# Altium schematic sheet Measurement.SchDoc
size A3; SheetNumber: 5; SheetTotal: 5
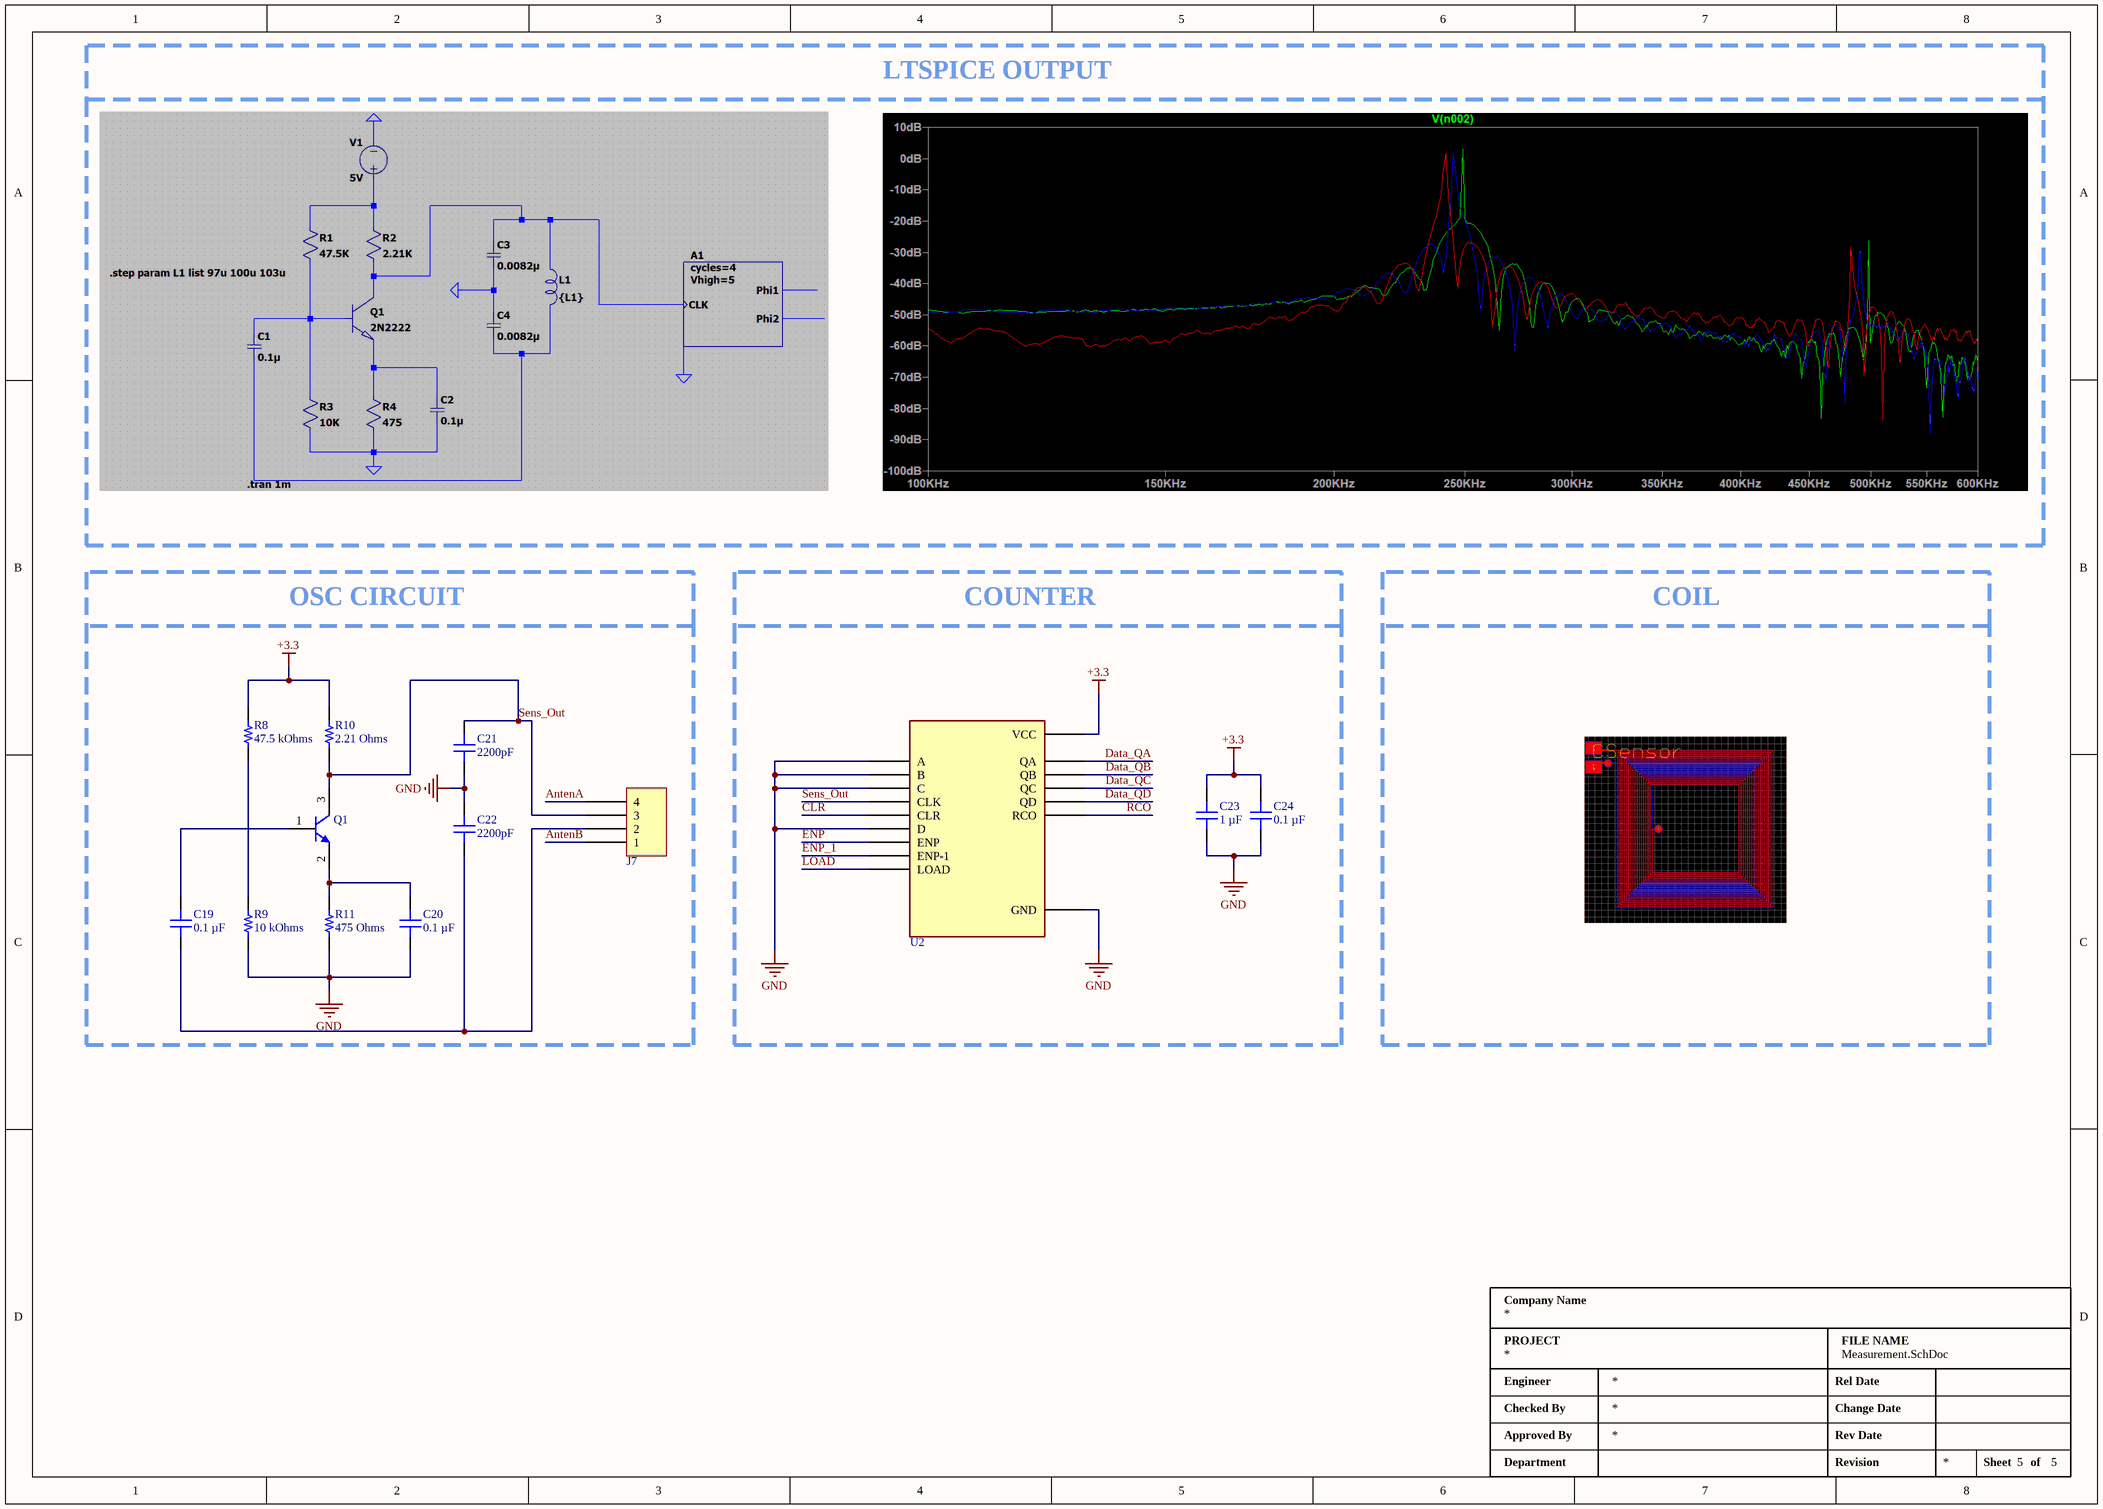
[diagram p0: Measurement.SchDoc]

## Parts
C19  0.1 µF  [CAP 0603_1608]
C20  0.1 µF  [CAP 0603_1608]
C21  2200pF  [CAP 0603_1608]
C22  2200pF  [CAP 0603_1608]
C23  1 µF  [CAP 0603_1608]
C24  0.1 µF  [CAP 0805_2012]
J7  SSW-104-03-T-S  [SAMTEC SSW-104-03-T-S]  (value not drawn)
Q1  MMBT489LT1G  [ON SEMI SOT-23-3]  (value not drawn)
R8  47.5 kOhms  [RES 0603_1608]
R9  10 kOhms  [RES 0603_1608]
R10  2.21 Ohms  [RES 0603_1608]
R11  475 Ohms  [RES 0603_1608]
U2  IC COUNTER 4BIT SYNC BIN 16-SOIC  [SOIC16]  (value not drawn)

## Blocks framed on the sheet
OSC CIRCUIT: C19-C22 J7 Q1 R8-R11
COUNTER: C23 C24 U2

## Nets
+3.3: C23.2 C24.2 R8.2 R10.2 U2.16(VCC)
GND: C20.1 C21.1 C22.2 C23.1 C24.1 R9.1 R11.1 U2.3(A) U2.4(B) U2.5(C) U2.6(D) U2.8(GND)
AntenA: J7.4
AntenB: J7.1
CLR: U2.1(CLR)
Data_QA: U2.14(QA)
Data_QB: U2.13(QB)
Data_QC: U2.12(QC)
Data_QD: U2.11(QD)
ENP: U2.7(ENP)
ENP_1: U2.10(ENP-1)
LOAD: U2.9(LOAD)
RCO: U2.15(RCO)
Sens_Out: C21.2 J7.3 Q1.3(C) R10.1 U2.2(CLK)
NetC19_1: C19.1 C22.1 J7.2
NetC19_2: C19.2 Q1.1(B)
NetC20_2: C20.2 Q1.2(E) R11.2
NetR8_1: R8.1 R9.2

## Notes on the sheet
- LTSPICE OUTPUT
- COIL
- Company Name
- Engineer
- PROJECT
- Rel Date
- FILE NAME
- Checked By
- Approved By
- Rev Date
- Change Date
- Department
- Revision
- Sheet
- of

## Library data of the parts
C19 C20 = CML0603Y5V104ZT50V: CAP, Y5V, 0603, 0.1UF, +80/-20%,; manufacturer: Stackpole Electronics Inc; Temperature Coefficient: Y5V (F); Tolerance: -20%, +80%; Voltage - Rated: 50V; Part Number: CML0603Y5V104ZT50V; Capacitance: 0.1 µF; Applications: General Purpose; componentlink1description: Datasheet; componentlink1url: http://www.seielect.com/Catalog/SEI-CML.PDF; componentlink2description: DigiKey Link; componentlink2url: https://www.digikey.com/en/products/detail/stackpole-electronics-inc/CML0603Y5V104ZT50V/10660018; Device Package: 0603 (1608 Metric); lastupdated: 9.02.2024 20:10:13; Lifecycle Status: Active; Minimum Order: 1; Mounting Type: Surface Mount, MLCC; Operating Temperature: -30°C ~ 85°C; Package / Case: 0603 (1608 Metric); packaging: TapeAndReel; partid: 26307; Part Status: Active; price: 0.01; series: CML; Size / Dimension: 0.063" L x 0.031" W (1.60mm x 0.80mm); Supplier 1: DigiKey; Supplier Part Number 1: 738-CML0603Y5V104ZT50VCT-ND; Thickness (Max): 0.035" (0.89mm); value: 0.1 µF
C21 C22 = 06031C222KAT4A: CAP CER 2200PF 100V X7R 0603; manufacturer: AVX Corporation; Tolerance: ±10%; Part Number: 06031C222KAT4A; Capacitance: 2200pF; Applications: General Purpose; componentlink1description: Datasheet; componentlink1url: http://datasheets.avx.com/X7RDielectric.pdf; componentlink2description: DigiKey Link; componentlink2url: http://digikey.com/product-detail/en/avx-corporation/06031C222KAT4A/478-12673-1-ND/9949211; Device Package: 0603 (1608 Metric); lastupdated: 2.09.2020 01:03:32; Lifecycle Status: Active; Minimum Order: 1; Mounting Type: Surface Mount, MLCC; Operating Temperature: -55°C ~ 125°C; Package / Case: 0603 (1608 Metric); packaging: TapeAndReel; partid: 4525; Part Status: Active; price: 0.02; series: -; Size / Dimension: 0.063" L x 0.032" W (1.60mm x 0.81mm); Supplier 1: DigiKey; Supplier Part Number 1: 478-12673-1-ND; Temperature Coefficient: X7R; Thickness (Max): 0.035" (0.90mm); value: 2200pF; Voltage - Rated: 100V
C23 = C0603X105M4RAC7867: CAP CER 0603 1UF 16V X7R 20%; manufacturer: KEMET; Part Number: C0603X105M4RAC7867; Capacitance: 1 µF; Applications: Boardflex Sensitive; componentlink1description: Datasheet; componentlink1url: https://api.kemet.com/component-edge/download/datasheet/C0603X105M4RAC7867.pdf; componentlink2description: DigiKey Link; componentlink2url: https://www.digikey.com/en/products/detail/kemet/C0603X105M4RAC7867/8635843; Device Package: 0603 (1608 Metric); Features: Soft Termination; lastupdated: 9.02.2024 20:10:28; Lifecycle Status: Active; Minimum Order: 1; Mounting Type: Surface Mount, MLCC; Operating Temperature: -55°C ~ 125°C; Package / Case: 0603 (1608 Metric); packaging: TapeAndReel; partid: 3937; Part Status: Active; price: 0.05; series: SMD Comm X7R Flex; Size / Dimension: 0.063" L x 0.031" W (1.60mm x 0.80mm); Supplier 1: DigiKey; Supplier Part Number 1: 399-17716-1-ND; Temperature Coefficient: X7R; Thickness (Max): 0.037" (0.95mm); Tolerance: ±20%; value: 1 µF; Voltage - Rated: 16V
C24 = C0805C104J1RECAUTO: CAP CER 0805 0.1UF 100V X7R 5%; manufacturer: KEMET; Part Number: C0805C104J1RECAUTO; Capacitance: 0.1 µF; Applications: Automotive, ESD Protection; componentlink1description: Datasheet; componentlink1url: https://api.kemet.com/component-edge/download/datasheet/C0805C104J1RECAUTO.pdf; componentlink2description: DigiKey Link; componentlink2url: https://www.digikey.com/en/products/detail/kemet/C0805C104J1RECAUTO/8646637; Device Package: 0805 (2012 Metric); lastupdated: 9.02.2024 20:15:06; Lifecycle Status: Active; Minimum Order: 1; Mounting Type: Surface Mount, MLCC; Operating Temperature: -55°C ~ 125°C; Package / Case: 0805 (2012 Metric); packaging: TapeAndReel; partid: 31979; Part Status: Active; price: 0.05; Ratings: AEC-Q200; series: ESD SMD Auto X7R; Size / Dimension: 0.079" L x 0.049" W (2.00mm x 1.25mm); Supplier 1: DigiKey; Supplier Part Number 1: 399-C0805C104J1RECAUTOCT-ND; Temperature Coefficient: X7R; Thickness (Max): 0.043" (1.10mm); Tolerance: ±5%; value: 0.1 µF; Voltage - Rated: 100V
J7 = SSW-104-03-T-S: CONN RCPT 4POS 0.1 TIN PCB; Manufacturer: Samtec Inc.; Connector Type: Receptacle; Current Rating (Amps): 5.7A per Contact; Material Flammability Rating: UL94 V-0; Number of Positions: 4; Number of Positions Loaded: All; Style: Board to Board or Cable; Part Number: SSW-104-03-T-S; ComponentLink2Description: DigiKey Link; ComponentLink2URL: http://digikey.com/product-detail/en/samtec-inc/SSW-104-03-T-S/SSW-104-03-T-S-ND/7874034; Contact Finish - Mating: Tin; Contact Finish - Post: Tin; Contact Type: Forked; Fastening Type: Push-Pull; Insulation Color: Black; LastUpdated: 21.06.2022 15:08:52; Lifecycle Status: Active; Minimum Order: 1; Mounting Type: Through Hole; Number of Rows: 1; Operating Temperature: -55°C ~ 105°C; Packaging: Bulk; Part Status: Active; Price: 0.83; Series: SSW; Supplier 1: DigiKey; Supplier Part Number 1: SSW-104-03-T-S-ND; Termination: Solder
Q1 = MMBT489LT1G: TRANS NPN 30V 1A SOT23; Manufacturer: ON Semiconductor; Current - Collector Cutoff (Max): 100nA; DC Current Gain (hFE) (Min) @ Ic, Vce: 300 @ 500mA, 5V; Frequency - Transition: 100MHz; Power - Max: 710mW; Vce Saturation (Max) @ Ib, Ic: 200mV @ 100mA, 1A; Part Number: MMBT489LT1G; ComponentLink1Description: Datasheet; ComponentLink1URL: http://www.onsemi.com/pub/Collateral/MMBT489LT1-D.PDF; ComponentLink2Description: DigiKey Link; ComponentLink2URL: http://digikey.com/product-detail/en/on-semiconductor/MMBT489LT1G/MMBT489LT1GOSCT-ND/2623471; Current - Collector (Ic) (Max): 1A; LastUpdated: 3.06.2024 20:24:13; Lifecycle Status: Active; Minimum Order: 1; Mounting Type: Surface Mount; Operating Temperature: -55°C ~ 150°C (TJ); Package / Case: TO-236-3, SC-59, SOT-23-3; Packaging: TapeAndReel; PartId: 152; Part Status: Active; Price: 0.09; Series: -; Supplier 1: DigiKey; Supplier Part Number 1: MMBT489LT1GOSCT-ND; Supplier Device Package: SOT-23-3 (TO-236); Transistor Type: NPN; Voltage - Collector Emitter Breakdown (Max): 30V
R8 = ERJ-PB3B4752V: RES SMD 47.5K OHM 0.1% 1/5W 0603; Manufacturer: Panasonic Electronic Components; Power (Watts): 0.2W, 1/5W; Temperature Coefficient: ±50ppm/°C; Part Number: ERJ-PB3B4752V; Value: 47.5 kOhms; ComponentLink1Description: Datasheet; ComponentLink1URL: https://industrial.panasonic.com/cdbs/www-data/pdf/RDM0000/AOA0000C328.pdf; ComponentLink2Description: DigiKey Link; ComponentLink2URL: https://www.digikey.com/en/products/detail/panasonic-electronic-components/ERJ-PB3B4752V/6212946; Composition: Thick Film; Device Package: 0603 (1608 Metric); Features: Automotive AEC-Q200, Pulse Withstanding; Height - Seated (Max): 0.022" (0.55mm); LastUpdated: 9.02.2024 20:43:36; Lifecycle Status: Active; Minimum Order: 1; Number of Terminations: 2; Operating Temperature: -55°C ~ 155°C; Package / Case: 0603 (1608 Metric); Packaging: TapeAndReel; PartId: 4941; Part Status: Active; Price: 0.02; Ratings: AEC-Q200; Resistance: 47.5 kOhms; Series: ERJ-PB3; Size / Dimension: 0.063" L x 0.031" W (1.60mm x 0.80mm); Supplier 1: DigiKey; Supplier Part Number 1: P20163CT-ND; Supplier Device Package: 0603; Tolerance: ±0.1%
R9 = RNCS0603BKE10K0: RES 10K OHM 0.1% 1/16W 0603; Manufacturer: Stackpole Electronics Inc; Power (Watts): 0.063W, 1/16W; Temperature Coefficient: ±25ppm/°C; Part Number: RNCS0603BKE10K0; Value: 10 kOhms; ComponentLink1Description: Datasheet; ComponentLink1URL: https://www.seielect.com/catalog/sei-rncs_rnch.pdf; ComponentLink2Description: DigiKey Link; ComponentLink2URL: https://www.digikey.com/en/products/detail/stackpole-electronics-inc/RNCS0603BKE10K0/1708836; Composition: Thin Film; Device Package: 0603 (1608 Metric); Features: Anti-Corrosive, Automotive AEC-Q200, Moisture Resistant; Height - Seated (Max): 0.022" (0.55mm); LastUpdated: 9.02.2024 20:43:37; Lifecycle Status: Active; Minimum Order: 1; Number of Terminations: 2; Operating Temperature: -55°C ~ 155°C; Package / Case: 0603 (1608 Metric); Packaging: TapeAndReel; PartId: 4838; Part Status: Active; Price: 0.06; Ratings: AEC-Q200; Resistance: 10 kOhms; Series: RNCS; Size / Dimension: 0.061" L x 0.031" W (1.55mm x 0.80mm); Supplier 1: DigiKey; Supplier Part Number 1: RNCS0603BKE10K0CT-ND; Supplier Device Package: 0603; Tolerance: ±0.1%
R10 = CPF0603B2R21E1: CPF 0603 2R21 0.1% 25PPM 1K RL; Manufacturer: TE Connectivity Passive Product; Power (Watts): 0.063W, 1/16W; Temperature Coefficient: ±25ppm/°C; Part Number: CPF0603B2R21E1; Value: 2.21 Ohms; ComponentLink1Description: Datasheet; ComponentLink1URL: https://www.te.com/commerce/DocumentDelivery/DDEController?Action=srchrtrv&DocNm=1773200&DocType=DS&DocLang=English; ComponentLink2Description: DigiKey Link; ComponentLink2URL: https://www.digikey.com/en/products/detail/te-connectivity-passive-product/CPF0603B2R21E1/14007137; Composition: Thin Film; Device Package: 0603 (1608 Metric); Height - Seated (Max): 0.022" (0.55mm); LastUpdated: 9.02.2024 20:41:20; Lifecycle Status: Active; Minimum Order: 1; Number of Terminations: 2; Operating Temperature: -55°C ~ 155°C; Package / Case: 0603 (1608 Metric); Packaging: TapeAndReel; PartId: 62166; Part Status: Active; Price: 0.12; Resistance: 2.21 Ohms; Series: CPF; Size / Dimension: 0.061" L x 0.031" W (1.55mm x 0.80mm); Supplier 1: DigiKey; Supplier Part Number 1: 1712-CPF0603B2R21E1CT-ND; Supplier Device Package: 0603; Tolerance: ±0.1%
R11 = ERJ-PB3D4750V: RES SMD 475 OHM 0.5% 1/5W 0603; Manufacturer: Panasonic Electronic Components; Power (Watts): 0.2W, 1/5W; Temperature Coefficient: ±50ppm/°C; Part Number: ERJ-PB3D4750V; Value: 475 Ohms; ComponentLink1Description: Datasheet; ComponentLink1URL: https://industrial.panasonic.com/cdbs/www-data/pdf/RDM0000/AOA0000C328.pdf; ComponentLink2Description: DigiKey Link; ComponentLink2URL: https://www.digikey.com/en/products/detail/panasonic-electronic-components/ERJ-PB3D4750V/6213029; Composition: Thick Film; Device Package: 0603 (1608 Metric); Features: Automotive AEC-Q200, Pulse Withstanding; Height - Seated (Max): 0.022" (0.55mm); LastUpdated: 9.02.2024 20:43:28; Lifecycle Status: Active; Minimum Order: 1; Number of Terminations: 2; Operating Temperature: -55°C ~ 155°C; Package / Case: 0603 (1608 Metric); Packaging: TapeAndReel; PartId: 7092; Part Status: Active; Price: 0.02; Ratings: AEC-Q200; Resistance: 475 Ohms; Series: ERJ-PB3; Size / Dimension: 0.063" L x 0.031" W (1.60mm x 0.80mm); Supplier 1: DigiKey; Supplier Part Number 1: P20246CT-ND; Supplier Device Package: 0603; Tolerance: ±0.5%
U2 = SN74HC163D: Manufacturer: Texas Instruments; Manufacturer Part Number: SN74HC163DR; Category: Counters; Supplier: Digikey; Supplier Part Number: 296-31790-1-ND; RoHS: Yes; Stock: 3569; Pricing: 1=0,27, 10=0,185, 25=0,164, 100=0,1408, 250=0,12964, 500=0,12294, 1000=0,11741 (USD); ComponentLink1URL: https://datasheet.ciiva.com/15093/getdatasheetpartid-393963-15093910.pdf?src-supplier=Verical; ComponentLink1Description: https://datasheet.ciiva.com/15093/getdatasheetpartid-393963-15093910.pdf?src-supplier=Verical; ComponentLink2URL: https://datasheet.ciiva.com/41456/001016672-da-01-en-ic-4bit-bin-cnt-sn74hc163dr-soic-16-tid-41456966.pdf?src-supplier=Conrad; ComponentLink2Description: https://datasheet.ciiva.com/41456/001016672-da-01-en-ic-4bit-bin-cnt-sn74hc163dr-soic-16-tid-41456966.pdf?src-supplier=Conrad; ComponentLink3URL: https://datasheet.ciiva.com/14296/sn54hc163-14296296.pdf?src-supplier=Avnet; ComponentLink3Description: https://datasheet.ciiva.com/14296/sn54hc163-14296296.pdf?src-supplier=Avnet